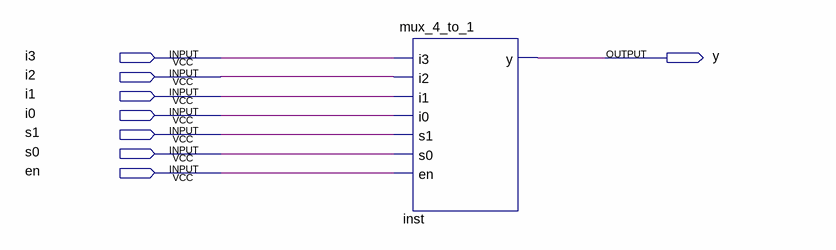
[diagram p0: schematic sheet]
// Quartus schematic Block1.bdf as structural Verilog: 1 symbols, 8 pins
module Block1 (
  input  i3,
  input  i2,
  input  i1,
  input  i0,
  input  s1,
  input  s0,
  input  en,
  output y
);

  mux_4_to_1 inst (.i3(i3), .i2(i2), .i1(i1), .i0(i0), .s1(s1), .s0(s0), .en(en), .y(y));
endmodule
